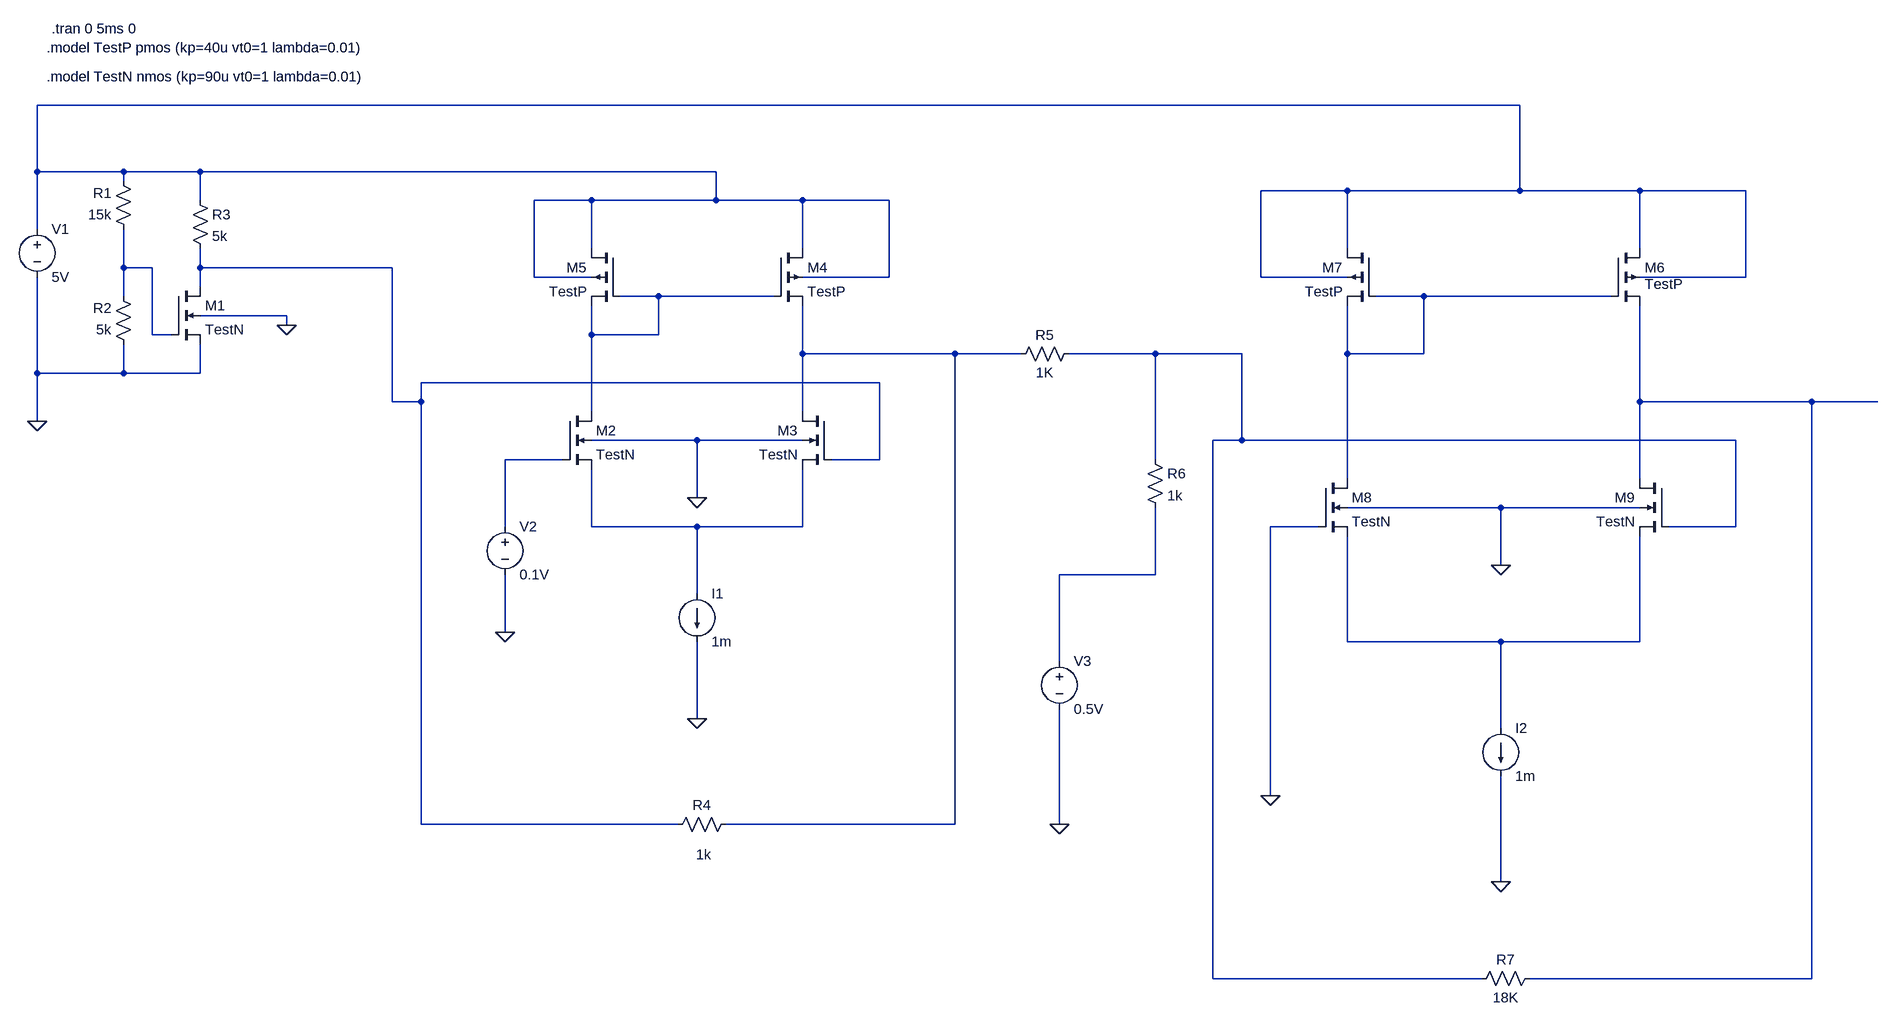
[diagram p0: schematic LTSpice_schematic.asc]
LTSpice_schematic.asc, the LTspice schematic file:
Version 4
SHEET 1 4024 1296
WIRE 2496 -224 -336 -224
WIRE -336 -112 -336 -224
WIRE -192 -112 -336 -112
WIRE -64 -112 -192 -112
WIRE 816 -112 -64 -112
WIRE -192 -96 -192 -112
WIRE 2208 -80 2064 -80
WIRE 2496 -80 2496 -224
WIRE 2496 -80 2208 -80
WIRE 2736 -80 2496 -80
WIRE 2912 -80 2736 -80
WIRE -64 -64 -64 -112
WIRE 608 -64 512 -64
WIRE 816 -64 816 -112
WIRE 816 -64 608 -64
WIRE 960 -64 816 -64
WIRE 1104 -64 960 -64
WIRE -336 -16 -336 -112
WIRE 608 16 608 -64
WIRE 960 16 960 -64
WIRE 2208 16 2208 -80
WIRE 2736 16 2736 -80
WIRE -192 48 -192 -16
WIRE -144 48 -192 48
WIRE -64 48 -64 16
WIRE 256 48 -64 48
WIRE 512 64 512 -64
WIRE 608 64 512 64
WIRE 1104 64 1104 -64
WIRE 1104 64 960 64
WIRE 2064 64 2064 -80
WIRE 2208 64 2064 64
WIRE 2912 64 2912 -80
WIRE 2912 64 2736 64
WIRE -64 80 -64 48
WIRE -192 96 -192 48
WIRE 720 96 656 96
WIRE 912 96 720 96
WIRE 2336 96 2256 96
WIRE 2688 96 2336 96
WIRE 80 128 -64 128
WIRE 80 144 80 128
WIRE -144 160 -144 48
WIRE -112 160 -144 160
WIRE 608 160 608 112
WIRE 720 160 720 96
WIRE 720 160 608 160
WIRE 960 192 960 112
WIRE 1392 192 960 192
WIRE 1664 192 1392 192
WIRE 1888 192 1744 192
WIRE 2032 192 1888 192
WIRE 2208 192 2208 112
WIRE 2336 192 2336 96
WIRE 2336 192 2208 192
WIRE -336 224 -336 64
WIRE -192 224 -192 176
WIRE -192 224 -336 224
WIRE -64 224 -64 176
WIRE -64 224 -192 224
WIRE 1088 240 304 240
WIRE 256 272 256 48
WIRE 304 272 304 240
WIRE 304 272 256 272
WIRE 2736 272 2736 112
WIRE 3072 272 2736 272
WIRE 3216 272 3072 272
WIRE 608 288 608 160
WIRE 960 288 960 192
WIRE -336 304 -336 224
WIRE 784 336 608 336
WIRE 960 336 784 336
WIRE 2032 336 2032 192
WIRE 2032 336 1984 336
WIRE 2896 336 2032 336
WIRE 560 368 464 368
WIRE 1088 368 1088 240
WIRE 1088 368 1008 368
WIRE 1888 368 1888 192
WIRE 2208 400 2208 192
WIRE 2736 400 2736 272
WIRE 784 432 784 336
WIRE 2464 448 2208 448
WIRE 2736 448 2464 448
WIRE 464 480 464 368
WIRE 608 480 608 384
WIRE 784 480 608 480
WIRE 960 480 960 384
WIRE 960 480 784 480
WIRE 2160 480 2080 480
WIRE 2896 480 2896 336
WIRE 2896 480 2784 480
WIRE 2464 544 2464 448
WIRE 1888 560 1888 448
WIRE 1888 560 1728 560
WIRE 784 592 784 480
WIRE 464 656 464 560
WIRE 2208 672 2208 496
WIRE 2464 672 2208 672
WIRE 2736 672 2736 496
WIRE 2736 672 2464 672
WIRE 1728 704 1728 560
WIRE 784 800 784 672
WIRE 2464 816 2464 672
WIRE 2080 928 2080 480
WIRE 304 976 304 272
WIRE 752 976 304 976
WIRE 1392 976 1392 192
WIRE 1392 976 832 976
WIRE 1728 976 1728 784
WIRE 2464 1072 2464 896
WIRE 1984 1248 1984 336
WIRE 2432 1248 1984 1248
WIRE 3072 1248 3072 272
WIRE 3072 1248 2512 1248
FLAG -336 304 0
FLAG 80 144 0
FLAG 784 432 0
FLAG 784 800 0
FLAG 464 656 0
FLAG 2464 544 0
FLAG 2464 1072 0
FLAG 1728 976 0
FLAG 2080 928 0
DATAFLAG -192 48 ""
DATAFLAG 3184 272 ""
SYMBOL nmos4 -112 80 R0
SYMATTR InstName M1
SYMATTR Value TestN
SYMATTR Value2 l=200u w=2000u
SYMBOL voltage -336 -32 R0
WINDOW 123 0 0 Left 0
WINDOW 39 0 0 Left 0
SYMATTR InstName V1
SYMATTR Value 5V
SYMBOL res -176 0 R180
WINDOW 0 36 76 Left 2
WINDOW 3 36 40 Left 2
SYMATTR InstName R1
SYMATTR Value 15k
SYMBOL res -176 192 R180
WINDOW 0 36 76 Left 2
WINDOW 3 36 40 Left 2
SYMATTR InstName R2
SYMATTR Value 5k
SYMBOL res -80 -80 R0
SYMATTR InstName R3
SYMATTR Value 5k
SYMBOL nmos4 560 288 R0
SYMATTR InstName M2
SYMATTR Value TestN
SYMATTR Value2 l=200u w=2000u
SYMBOL nmos4 1008 288 M0
SYMATTR InstName M3
SYMATTR Value TestN
SYMATTR Value2 l=200u w=2000u
SYMBOL pmos4 912 16 R0
SYMATTR InstName M4
SYMATTR Value TestP
SYMATTR Value2 l=200u w=2000u
SYMBOL pmos4 656 16 M0
SYMATTR InstName M5
SYMATTR Value TestP
SYMATTR Value2 l=200u w=2000u
SYMBOL current 784 592 R0
WINDOW 123 0 0 Left 0
WINDOW 39 0 0 Left 0
SYMATTR InstName I1
SYMATTR Value 1m
SYMBOL voltage 464 464 R0
WINDOW 123 0 0 Left 0
WINDOW 39 0 0 Left 0
SYMATTR InstName V2
SYMATTR Value 0.1V
SYMBOL res 848 960 R90
WINDOW 0 0 56 VBottom 2
WINDOW 3 51 53 VTop 2
SYMATTR InstName R4
SYMATTR Value 1k
SYMBOL pmos4 2688 16 R0
WINDOW 3 56 60 Left 2
SYMATTR Value TestP
SYMATTR InstName M6
SYMATTR Value2 l=200u w=2000u
SYMBOL pmos4 2256 16 M0
SYMATTR InstName M7
SYMATTR Value TestP
SYMATTR Value2 l=200u w=2000u
SYMBOL nmos4 2160 400 R0
SYMATTR InstName M8
SYMATTR Value TestN
SYMATTR Value2 l=200u w=2000u
SYMBOL nmos4 2784 400 M0
SYMATTR InstName M9
SYMATTR Value TestN
SYMATTR Value2 l=200u w=2000u
SYMBOL current 2464 816 R0
WINDOW 123 0 0 Left 0
WINDOW 39 0 0 Left 0
SYMATTR InstName I2
SYMATTR Value 1m
SYMBOL voltage 1728 688 R0
WINDOW 123 0 0 Left 0
WINDOW 39 0 0 Left 0
SYMATTR InstName V3
SYMATTR Value 0.5V
SYMBOL res 1872 352 R0
SYMATTR InstName R6
SYMATTR Value 1k
SYMBOL res 2528 1232 R90
WINDOW 0 0 56 VBottom 2
WINDOW 3 32 56 VTop 2
SYMATTR InstName R7
SYMATTR Value 18K
SYMBOL res 1760 176 R90
WINDOW 0 0 56 VBottom 2
WINDOW 3 32 56 VTop 2
SYMATTR InstName R5
SYMATTR Value 1K
TEXT -320 -272 Left 2 !.model TestN nmos (kp=90u vt0=1 lambda=0.01)
TEXT -312 -352 Left 2 !.tran 0 5ms 0
TEXT -320 -320 Left 2 !.model TestP pmos (kp=40u vt0=1 lambda=0.01)

The netlist it stands for:
* LTSpice_schematic.asc
M1 N003 N002 0 0 TestN l=200u w=2000u
V1 N001 0 5V
R1 N002 N001 15k
R2 0 N002 5k
R3 N001 N003 5k
M2 N004 N009 N010 0 TestN l=200u w=2000u
M3 N006 N003 N010 0 TestN l=200u w=2000u
M4 N001 N004 N006 N001 TestP l=200u w=2000u
M5 N001 N004 N004 N001 TestP l=200u w=2000u
I1 N010 0 1m
V2 N009 0 0.1V
R4 N006 N003 1k
M6 N001 N005 N008 N001 TestP l=200u w=2000u
M7 N001 N005 N005 N001 TestP l=200u w=2000u
M8 N005 0 N012 0 TestN l=200u w=2000u
M9 N008 N007 N012 0 TestN l=200u w=2000u
I2 N012 0 1m
V3 N011 0 0.5V
R6 N007 N011 1k
R7 N008 N007 18K
R5 N007 N006 1K
.model NMOS NMOS
.model PMOS PMOS
.lib standard.mos
.model TestN nmos (kp=90u vt0=1 lambda=0.01)
.tran 0 5ms 0
.model TestP pmos (kp=40u vt0=1 lambda=0.01)
.backanno
.end